# Altium schematic sheet Power Supply Unit.SchDoc: Power Supply Unit
size A4; DrawnBy: Maxime Tousignant-Tremblay; DocumentNumber: GPH-3110-1; Revision: 1; SheetNumber: 1; SheetTotal: 5; SPICEModelCacheSEIOAEZJ: <root> / <DocumentId>SEIOAEZJ</DocumentId> / </root>
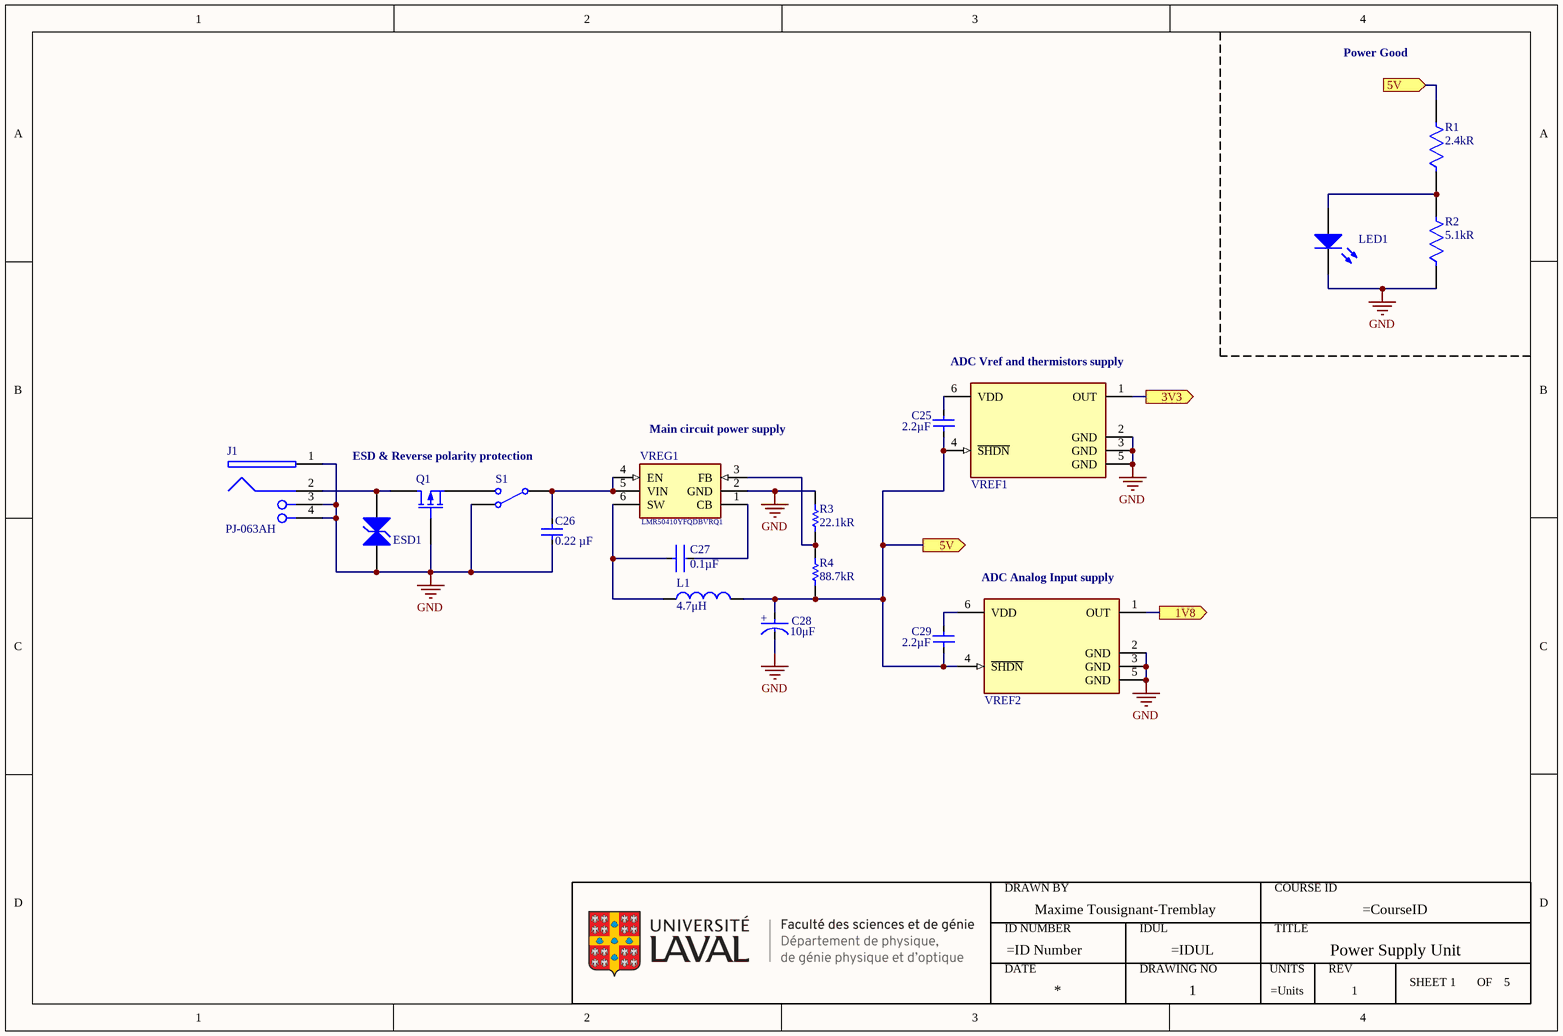
[diagram p0: Power Supply Unit.SchDoc]

## Parts
*2  ULaval FSG-DPGPO  (value not drawn)  (graphical)
C25  Capacitance: 2.2µF  [CC0603KRX7R5BB225]  (hidden comment: CC0603KRX7R5BB225)
C26  0.22 µF  [GRM188R71E224KA88D]
C27  Capacitance: 0.1µF  [CAP 0603_1608]
C28  value 10μF  [293D106X9016B2TE3]  (hidden comment: 293D106X9016B2TE3)
C29  Capacitance: 2.2µF  [CC0603KRX7R5BB225]  (hidden comment: CC0603KRX7R5BB225)
ESD1  SMBJ20CA  [SMBJ20CA]  (value not drawn)
J1  PJ-063AH  [PJ-063AH]
L1  value 4.7μH  [ILSB1206ER4R7K]  (hidden comment: ILSB1206ER4R7K)
LED1  151053GS03000  [Type 5mm]  (value not drawn)
Q1  IRLML9303TRPBF  [IRLML9303TRPBF]  (value not drawn)
R1  value 2.4kR  [FP-AC0603-IPC_C]  (hidden comment: AC0603FR-072K4L)
R2  value 5.1kR  [FP-AC0603-IPC_C]  (hidden comment: AC0603FR-075K1L)
R3  value 22.1kR  [CRCW060322K1FKEA-Footprint-2]  (hidden comment: CRCW060322K1FKEA)
R4  value 88.7kR  [FP-CRCW0603-e3-IPC_B]  (hidden comment: CRCW060388K7FKEB)
S1  Single-Pole, Double-Throw Switch  (value not drawn)
VREF1  MCP1501T-33E/CHY  [MCP1501T-33E/CHY]  (value not drawn)
VREF2  MCP1501T-18E/CHY  [MCP1501T-18E/CHY]  (value not drawn)
VREG1  LMR50410YFQDBVRQ1  [LMR50410YFQDBVRQ1]

## Ports
1V8 (out), 3V3 (out), 5V (in), 5V (out)

## Nets
GND: C26.1 C28.1(C) ESD1.2 J1.1 J1.3(SHLD) J1.4(SHLD) LED1.1(K) Q1.2(G) R2.1 R3.2 S1.3 VREF1.2(GND) VREF1.3(GND) VREF1.5(GND) VREF2.2(GND) VREF2.3(GND) VREF2.5(GND) VREG1.2(GND)
1V8: VREF2.1(OUT) ; port 1V8
3V3: VREF1.1(OUT) ; port 3V3
5V: C25.2 C28.2(A) C29.2 L1.2 R1.2 R4.1 VREF1.4(~{SHDN}) VREF2.4(~{SHDN}) ; port 5V
NetC25_1: C25.1 VREF1.6(VDD)
NetC26_2: C26.2 S1.1 VREG1.4(EN) VREG1.5(VIN)
NetC27_1: C27.1 L1.1 VREG1.6(SW)
NetC27_2: C27.2 VREG1.1(CB)
NetC29_1: C29.1 VREF2.6(VDD)
NetESD1_1: ESD1.1 J1.2 Q1.1(D)
NetLED1_2: LED1.2(A) R1.1 R2.2
NetQ1_3: Q1.3(S) S1.2
NetR3_1: R3.1 R4.2 VREG1.3(FB)

## Notes on the sheet
- Power Good
- (near VREF1) ADC Vref and thermistors supply
- (near VREG1) Main circuit power supply
- ESD & Reverse polarity protection
- (near VREF2) ADC Analog Input supply
- (in symbol 293D106X9016B2TE3) +
- (in symbol ULaval FSG-DPGPO) DRAWN BY; COURSE ID; ID NUMBER; IDUL; TITLE; DATE; DRAWING NO; UNITS; REV; SHEET; OF

## Library data of the parts
C25 C29 = CC0603KRX7R5BB225: 2.2 µF ±10% 6.3V Ceramic Capacitor X7R 0603 (1608 Metric); manufacturer: Yageo; Part Number: CC0603KRX7R5BB225; Applications: General Purpose; componentlink1description: Datasheet; componentlink1url: https://www.yageo.com/upload/media/product/productsearch/datasheet/mlcc/UPY-GPHC_X7R_6.3V-to-50V_18.pdf; componentlink2description: DigiKey Link; componentlink2url: https://www.digikey.com/en/products/detail/yageo/CC0603KRX7R5BB225/5195203; Device Package: 0603 (1608 Metric); lastupdated: 2023-03-06 20:08:32; Lifecycle Status: Active; Minimum Order: 1; Mounting Type: Surface Mount, MLCC; Operating Temperature: -55°C ~ 125°C; Package / Case: 0603 (1608 Metric); packaging: TapeAndReel; partid: 41539; Part Status: Active; price: 0.01; series: CC; Size / Dimension: 0.063" L x 0.031" W (1.60mm x 0.80mm); Temperature Coefficient: X7R; Thickness (Max): 0.035" (0.90mm); Tolerance: ±10%; Voltage - Rated: 6.3V; ComponentLink1Description: Datasheet; ComponentLink1URL: *; Supplier 1: Digi-Key; Supplier Part Number 1: 311-1795-1-ND; Supplier 2: Digi-Key; Supplier Part Number 2: 311-1795-6-ND; Supplier 3: Digi-Key; Supplier Part Number 3: 311-1795-2-ND
C26 = GRM188R71E224KA88D: 0.22 µF ±10% 25V Ceramic Capacitor X7R 0603 (1608 Metric); manufacturer: Murata Electronics; Part Number: GRM188R71E224KA88D; Applications: General Purpose; Capacitance: 0.22 µF; componentlink1description: Datasheet; componentlink1url: https://www.murata.com/~/media/webrenewal/support/library/catalog/products/capacitor/mlcc/c02e.ashx?la=en-us; componentlink2description: DigiKey Link; componentlink2url: https://www.digikey.com/en/products/detail/murata-electronics/GRM188R71E224KA88D/702554; Device Package: 0603 (1608 Metric); lastupdated: 2023-03-05 20:08:17; Lifecycle Status: Active; Minimum Order: 1; Mounting Type: Surface Mount, MLCC; Operating Temperature: -55°C ~ 125°C; Package / Case: 0603 (1608 Metric); packaging: TapeAndReel; partid: 11196; Part Status: Active; price: 0.01; series: GRM; Size / Dimension: 0.063" L x 0.031" W (1.60mm x 0.80mm); Temperature Coefficient: X7R; Thickness (Max): 0.035" (0.90mm); Tolerance: ±10%; Voltage - Rated: 25V; Supplier 1: Digi-Key; Supplier Part Number 1: 490-3290-1-ND; Supplier 2: Digi-Key; Supplier Part Number 2: 490-3290-6-ND; Supplier 3: Digi-Key; Supplier Part Number 3: 490-3290-2-ND; Value: 0.22 µF
C27 = CC0603JRX7R9BB104: 0.1 µF ±5% 50V Ceramic Capacitor X7R 0603 (1608 Metric); manufacturer: Yageo; Part Number: CC0603JRX7R9BB104; Applications: General Purpose; componentlink1description: Datasheet; componentlink1url: https://www.yageo.com/upload/media/product/productsearch/datasheet/mlcc/UPY-GPHC_X7R_6.3V-to-50V_18.pdf; componentlink2description: DigiKey Link; componentlink2url: https://www.digikey.com/en/products/detail/yageo/CC0603JRX7R9BB104/5195188; Device Package: 0603 (1608 Metric); lastupdated: 2023-03-06 20:08:09; Lifecycle Status: Active; Minimum Order: 1; Mounting Type: Surface Mount, MLCC; Operating Temperature: -55°C ~ 125°C; Package / Case: 0603 (1608 Metric); packaging: TapeAndReel; partid: 12474; Part Status: Active; price: 0.01; series: CC; Size / Dimension: 0.063" L x 0.031" W (1.60mm x 0.80mm); Supplier 1: DigiKey; Supplier Part Number 1: 311-1779-1-ND; Temperature Coefficient: X7R; Thickness (Max): 0.035" (0.90mm); Tolerance: ±5%; Voltage - Rated: 50V
C28 = 293D106X9016B2TE3: 10 µF Molded Tantalum Capacitors 16 V 1411 (3528 Metric) 2Ohm; Voltage Rating: 16V; Case Code (Imperial): 1411; Supplier 1: Digi-Key; Supplier Part Number 1: 718-1124-1-ND; Supplier 2: Digi-Key; Supplier Part Number 2: 718-1124-6-ND; Supplier 3: Digi-Key; Supplier Part Number 3: 718-1124-2-ND
ESD1 = SMBJ20CA: 32.4V Clamp 18.6A Ipp Tvs Diode Surface Mount SMB (DO-214AA); Max Power Dissipation: 600W; Diode Type: Zener; Element Configuration: Single; Reverse Standoff Voltage: 20V; Direction: Bidirectional; Max Breakdown Voltage: 25.5V; Min Breakdown Voltage: 22.2V; Max Surge Current: 100A; Peak Pulse Current: 18.6A; ComponentLink1Description: Datasheet; ComponentLink1URL: https://www.bourns.com/docs/Product-Datasheets/SMBJ.pdf; Supplier 1: Digi-Key; Supplier Part Number 1: SMBJ20CABCT-ND; Supplier 2: Digi-Key; Supplier Part Number 2: SMBJ20CABDKR-ND
J1 = PJ-063AH: Power Barrel Connector Jack 2.10mm ID (0.083"), 5.50mm OD (0.217") Through Hole, Right Angle; Current Rating: 8A; Shielding: Shielded; Voltage Rating: 24V; Insulation Resistance: 100MR; Number of Conductors: 2; Supplier 1: Digi-Key; Supplier Part Number 1: CP-063AH-ND; ComponentLink1Description: Datasheet; ComponentLink1URL: https://www.cuidevices.com/product/resource/pj-063ah.pdf; Max Operating Temperature: 85°C; Min Operating Temperature: -25°C; Contact Material: Copper; Contact Plating: Nickel; Flammability Rating: UL94 V-0
L1 = ILSB1206ER4R7K: 4.7 µH Shielded Multilayer Inductor 50 mA 900mOhm Max 1206 (3216 Metric); Tolerance: 10%; Core Material: Ferrite; Self Resonant Frequency: 41MHz; Supplier 1: Digi-Key; Supplier Part Number 1: 541-4372-1-ND; Supplier 2: Digi-Key; Supplier Part Number 2: 541-4372-6-ND; Supplier 3: Digi-Key; Supplier Part Number 3: 541-4372-2-ND; Case Code (Imperial): 1206; Min Operating Temperature: -55°C; Max Operating Temperature: 125°C; Width: 1.6mm; Depth: 1.8mm; Weight: 0.000353oz; ComponentLink1Description: Datasheet; ComponentLink1URL: https://www.vishay.com/docs/34029/ilsb1206.pdf
LED1 = CMP-007-00044-1: Led, Green, T-1 3/4 (5Mm), 522 Nm, 3.4 V, 30 Ma, 10 Cd Rohs Compliant: Yes; Lens Style: Round,Domed,Circular; Viewing Angle: 30°; Lens Transparency: Clear; Luminous Intensity: 10000mcd; Forward Voltage: 3.4V; Dominant Wavelength: 522nm; Forward Current: 30mA; Test Current: 20mA; Lens Color: Colorless; Package Quantity: 1; Height: 8.85mm; RoHS Compliant: Yes; Max Operating Temperature: 85°C; Packaging: Bulk; Wavelength: 522nm; Lens Size: 5mm; Color: Green; Mounting Technology: Through Hole; Series: WL-TMRW; Case/Package: Radial; Min Operating Temperature: -40°C
Q1 = IRLML9303TRPBF: P-Channel 30 V 2.3A (Ta) 1.25W (Ta) Surface Mount Micro3™/SOT-23; Manufacturer: Infineon Technologies; Drain to Source Voltage (Vdss): 30 V; Drive Voltage (Max Rds On,  Min Rds On): 4.5V, 10V; Gate Charge (Qg) (Max) @ Vgs: 2 nC @ 4.5 V; Input Capacitance (Ciss) (Max) @ Vds: 160 pF @ 25 V; Rds On (Max) @ Id, Vgs: 165mOhm @ 2.3A, 10V; Vgs (Max): ±20V; Vgs(th) (Max) @ Id: 2.4V @ 10µA; Part Number: IRLML9303TRPBF; ComponentLink1Description: Datasheet; ComponentLink1URL: https://www.infineon.com/dgdl/irlml9303pbf.pdf?fileId=5546d462533600a401535668ef1d2642; ComponentLink2Description: DigiKey Link; ComponentLink2URL: https://www.digikey.com/en/products/detail/infineon-technologies/IRLML9303TRPBF/2354147; Current - Continuous Drain (Id) @ 25°C: 2.3A (Ta); FET Type: P-Channel; LastUpdated: 2023-03-05 21:05:43; Lifecycle Status: Active; Minimum Order: 1; Mounting Type: Surface Mount; Operating Temperature: -55°C ~ 150°C (TJ); Package / Case: TO-236-3, SC-59, SOT-23-3; Packaging: TapeAndReel; Part Status: Active; Power Dissipation (Max): 1.25W (Ta); Price: 0.11; Series: HEXFET®; Supplier Device Package: Micro3™/SOT-23; Technology: MOSFET (Metal Oxide); Supplier 1: Digi-Key; Supplier Part Number 1: IRLML9303TRPBFCT-ND; Supplier 2: Digi-Key; Supplier Part Number 2: IRLML9303TRPBFDKR-ND; Supplier 3: Digi-Key; Supplier Part Number 3: IRLML9303TRPBFTR-ND
R1 = CMP-009-00195-2: Res Thick Film 0603 2.4K Ohm 1% 0.1W(1/10W) ±100ppm/C Pad SMD Automotive T/R; Power Rating: 100mW; Voltage Rating: 50V; Temperature Coefficient: 100ppm/°C; Termination: SMD/SMT; Case Code (Metric): 1608; Number of Terminations: 2; Min Operating Temperature: -55°C; Width: 0.8mm; Length: 0.063inch; Tolerance: 1%; Height: 0.022inch; Case Code (Imperial): 0603; Max Operating Temperature: 155°C; Weight: 7.1E-05oz; Packaging: Tape and Reel; Resistor Type: Thick Film; Case/Package: 0603; Ratings: AEC-Q200; RoHS Compliant: Yes; Features: Moisture Resistant,Automotive AEC-Q200; Max Power Dissipation: 100mW; Series: AC
R2 = CMP-009-00196-1: Res Thick Film 0603 5.1K Ohm 1% 1/10W ±100ppm/°C Molded SMD Paper T/R; Voltage Rating: 50V; Power Rating: 100mW; Case/Package: 0603; Case Code (Imperial): 0603; Ratings: AEC-Q200; Width: 0.8mm; Tolerance: 1%; Max Operating Temperature: 155°C; Number of Terminations: 2; Case Code (Metric): 1608; Resistor Type: Thick Film; Packaging: Tape and Reel; RoHS Compliant: Yes; Min Operating Temperature: -55°C; Height: 0.45mm; Series: AC; Max Power Dissipation: 100mW; Weight: 7.1E-05oz; Features: Moisture Resistant,Automotive AEC-Q200; Termination: SMD/SMT; Length: 1.6mm; Temperature Coefficient: 100ppm/°C
R3 = CMP-009-00200-2: Res Thick Film 0603 22.1K Ohm 1% 1/10W ±100ppm/°C Molded SMD SMD Paper T/R; Voltage Rating (DC): 75V; Max Power Dissipation: 100mW; Number of Terminations: 2; Tolerance: 1%; Construction: Rectangular; Packaging: Tape and Reel; Case Code (Imperial): 0603; Termination: SMD/SMT; Series: CRCW; Temperature Coefficient: 100ppm/°C; Depth: 0.85mm; Military Standard: Not; Height: 0.45mm; Weight: 7.1E-05oz; Package Quantity: 10; Radiation Hardening: No; Width: 0.033inch; Case Code (Metric): 1608; Mounting Technology: Surface Mount; Min Operating Temperature: -55°C; Voltage Rating: 75V; RoHS Compliant: Yes; Case/Package: 0603; Max Operating Temperature: 155°C; Lead Free: Lead Free; Contact Plating: Tin; Resistance Tolerance: 1%; Resistor Type: Thick Film; Power Rating: 100mW; Ratings: AEC-Q200; Features: Automotive AEC-Q200; Technology: THICK FILM; Length: 1.55mm
R4 = CMP-009-00199-2: D11/CRCW0603 100 88K7 1% ET5 e3; Max Power Dissipation: 100mW; Voltage Rating: 75V; Temperature Coefficient: 100ppm/°C; RoHS Compliant: Yes; Min Operating Temperature: -55°C; Packaging: Tape and Reel; Weight: 7.1E-05oz; Military Standard: Not; Case Code (Metric): 1608; Tolerance: 1%; Power Rating: 100mW; Resistor Type: Thick Film; Features: Automotive AEC-Q200; Construction: Rectangular; Length: 0.061inch; Case/Package: 0603; Number of Terminations: 2; Lead Free: Lead Free; Width: 0.85mm; Max Operating Temperature: 155°C; Package Quantity: 10000; Height: 0.02inch; Depth: 0.85mm; Termination: SMD/SMT; Case Code (Imperial): 0603; Series: CRCW
S1 = SPDT SW: nodeUP_closed: 1; Rclosed: 1m; Ropen: 1Meg; SimulationGenericComponent: True
VREF1 = MCP1501T-33E/CHY: Series Voltage Reference IC Fixed 3.3V V ±0.1% 20 mA SOT-23-6; Temperature Coefficient: 50ppm/°C; Output Current: 20mA; Tolerance: 0.08%; Operating Supply Current: 550μA; ComponentLink1Description: New link; ComponentLink1URL: *; Reference Type: Series; Case/Package: SOT-23-6; Output Type: Fixed; Min Output Voltage: 3.3V; Min Operating Temperature: -40°C; Max Operating Temperature: 125°C; Supplier 1: Digi-Key; Supplier Part Number 1: MCP1501T-33E/CHYCT-ND; Supplier 2: Digi-Key; Supplier Part Number 2: MCP1501T-33E/CHYDKR-ND; Supplier 3: Digi-Key; Supplier Part Number 3: MCP1501T-33E/CHYTR-ND
VREF2 = MCP1501T-18E/CHY: Series Voltage Reference IC Fixed 31.8V V ±0.1% 20 mA SOT-23-6; Temperature Coefficient: 50ppm/°C; Output Current: 20mA; Min Output Voltage: 1.8V; Tolerance: 0.08%; Operating Supply Current: 550μA; ComponentLink1Description: New link; ComponentLink1URL: *; Reference Type: Series; Case/Package: SOT-23-6; Output Type: Fixed; Min Operating Temperature: -40°C; Max Operating Temperature: 125°C; Supplier 1: Digi-Key; Supplier Part Number 1: MCP1501T-18E/CHYCT-ND; Supplier 2: Digi-Key; Supplier Part Number 2: MCP1501T-18E/CHYDKR-ND
VREG1 = LMR50410YFQDBVRQ1: Buck Switching Regulator IC Positive Adjustable 1V 1 Output 1A SOT-23-6; Manufacturer_Name: Texas Instruments; Datasheet Link: https://www.ti.com/product/LMR50410-Q1; Height: 1.45mm; Manufacturer_Part_Number: LMR50410YFQDBVRQ1; Mouser Part Number: 595-MR50410YFQDBVRQ1; Mouser Price/Stock: https://www.mouser.co.uk/ProductDetail/Texas-Instruments/LMR50410YFQDBVRQ1?qs=81r%252BiQLm7BRUAgUFqYZycA%3D%3D; Arrow Part Number: LMR50410YFQDBVRQ1; Arrow Price/Stock: https://www.arrow.com/en/products/lmr50410yfqdbvrq1/texas-instruments?region=nac; Supplier 1: Digi-Key; Supplier Part Number 1: 296-LMR50410YFQDBVRQ1CT-ND; Supplier 2: Digi-Key; Supplier Part Number 2: 296-LMR50410YFQDBVRQ1DKR-ND; Supplier 3: Digi-Key; Supplier Part Number 3: 296-LMR50410YFQDBVRQ1TR-ND